# EasyEDA Pro project NI接口485_测试板子_3.eprj, schematic Schematic2
Create Date: 2023-08-04; Page Name: 接NI; Project Name: NI接口485_测试板子_3; Schematic Name: Schematic2; Update Date: 2023-08-29; Company: 嘉立创EDA; Page Size: A4; Version: V1.0
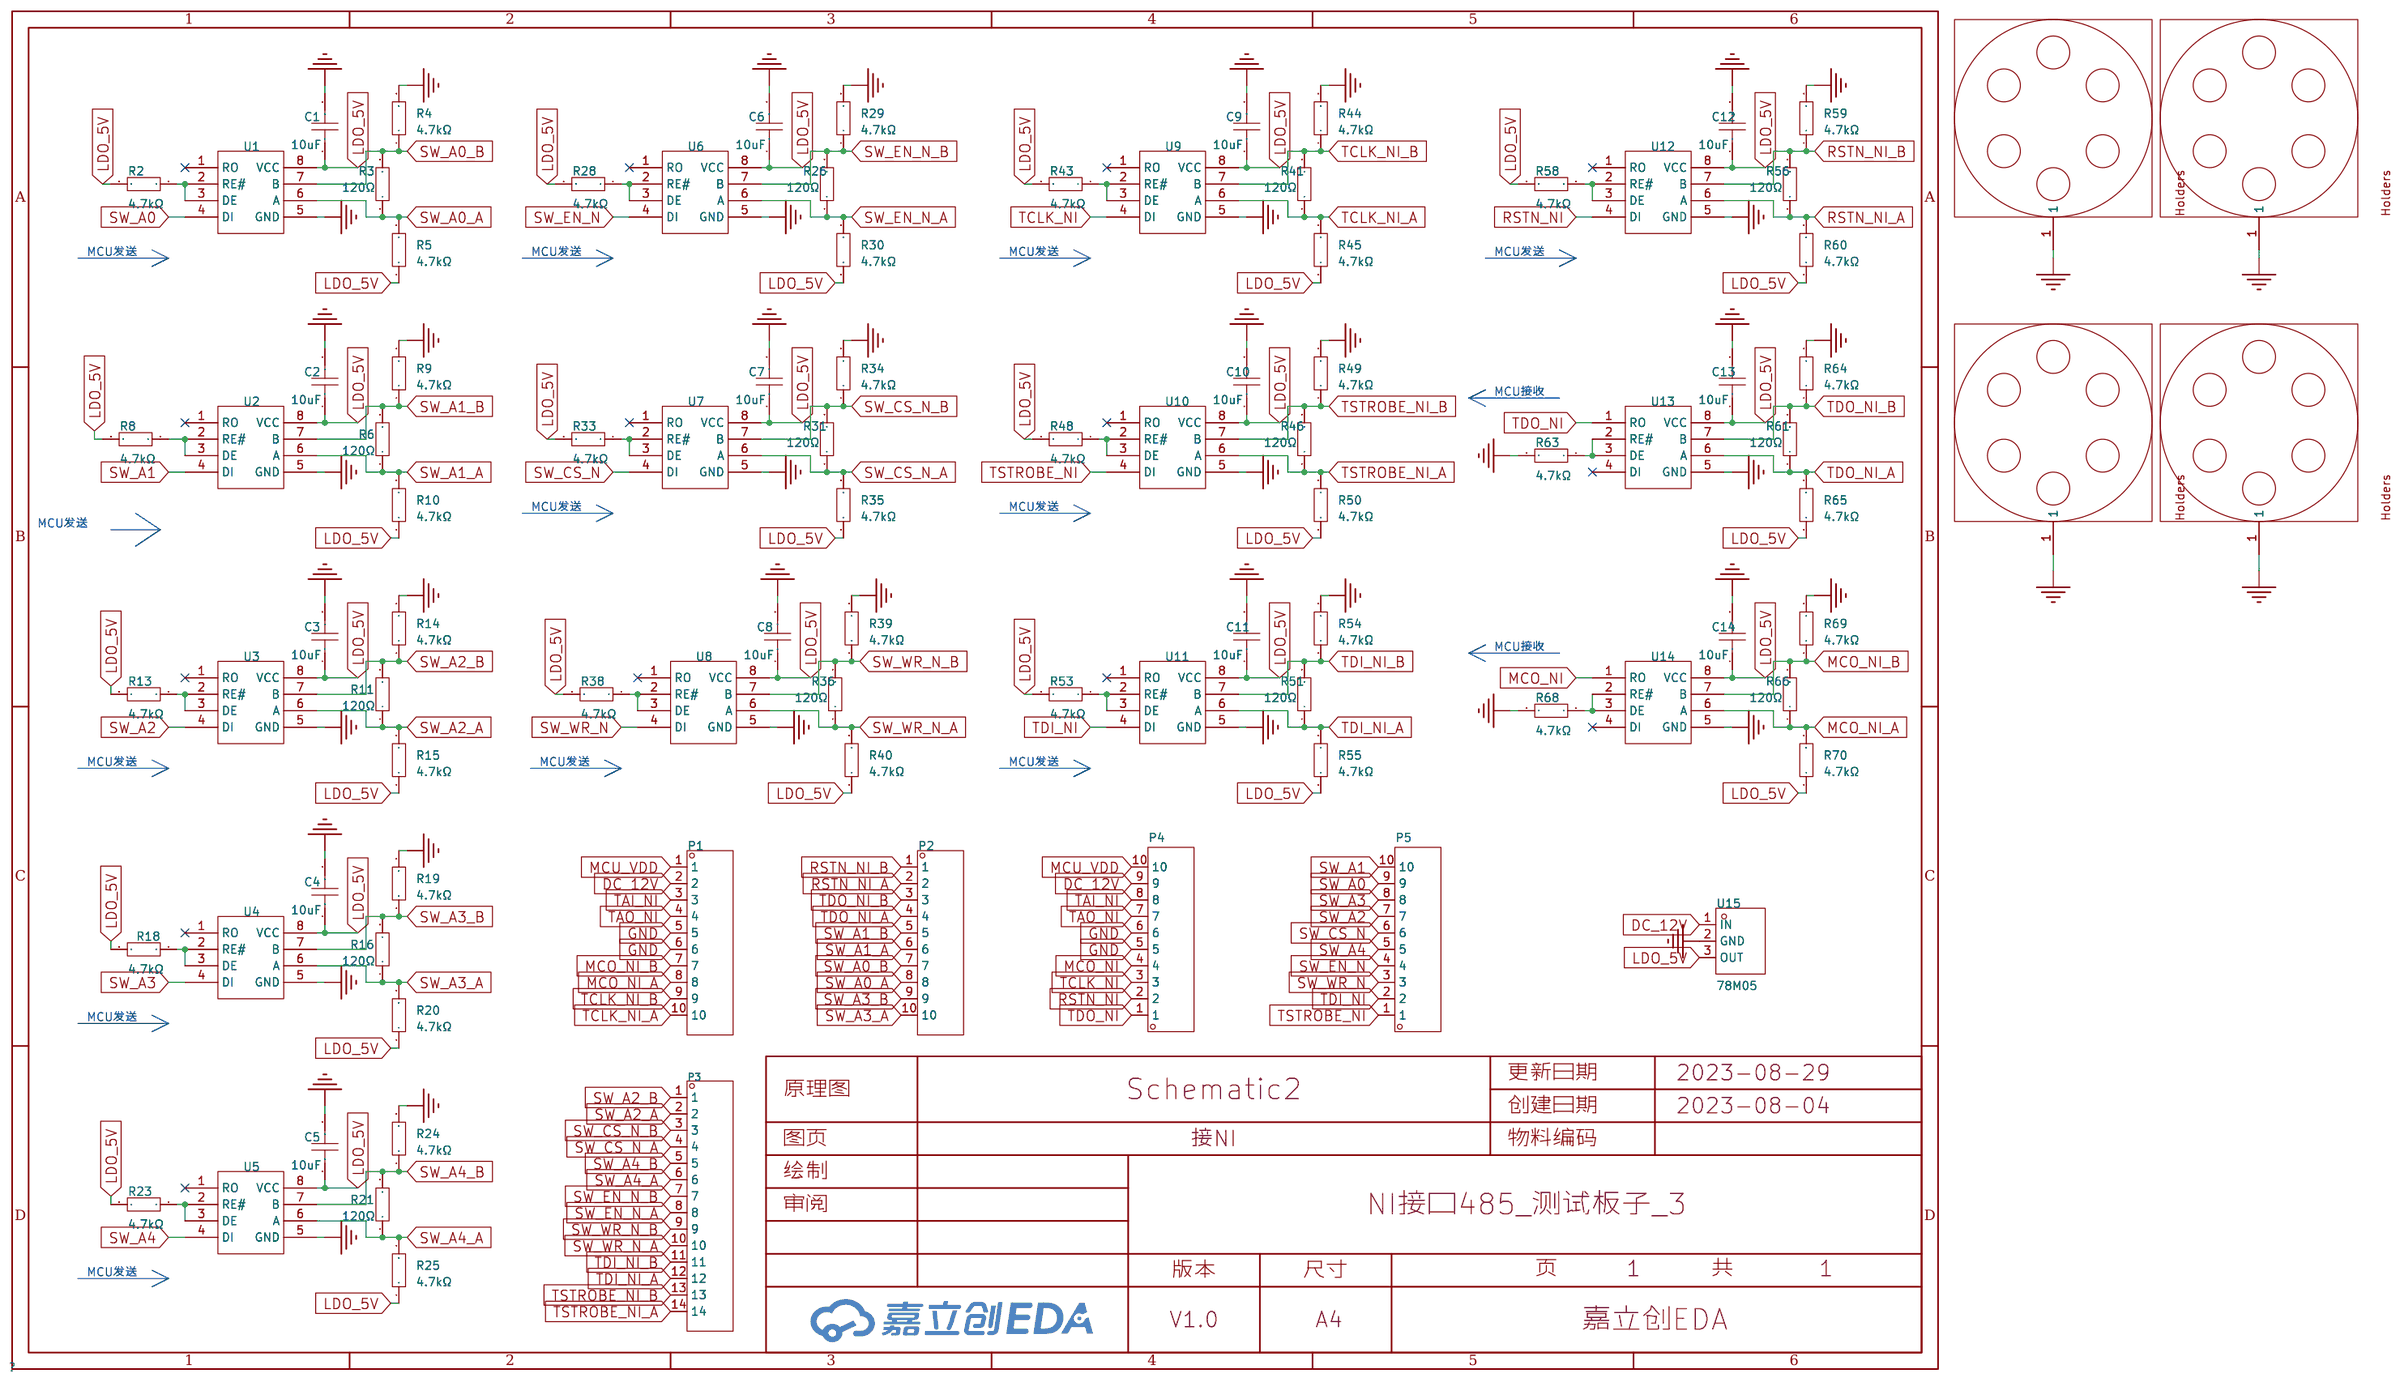
[diagram p1: schematic sheet]

## Parts
C1  10uF  [C0603]
C2  10uF  [C0603]
C3  10uF  [C0603]
C4  10uF  [C0603]
C5  10uF  [C0603]
C6  10uF  [C0603]
C7  10uF  [C0603]
C8  10uF  [C0603]
C9  10uF  [C0603]
C10  10uF  [C0603]
C11  10uF  [C0603]
C12  10uF  [C0603]
C13  10uF  [C0603]
C14  10uF  [C0603]
J1  -  [DEMO板安装孔]
J2  -  [DEMO板安装孔]
J3  -  [DEMO板安装孔]
J4  -  [DEMO板安装孔]
P1  WJ15EDGRC-3.81-10P  [CONN-TH_10P-P3.81_WJ15EDGRC-3.81-10P]
P2  WJ15EDGRC-3.81-10P  [CONN-TH_10P-P3.81_WJ15EDGRC-3.81-10P]
P3  WJ15EDGRC-3.81-14P  [CONN-TH_14P-P3.81_WJ15EDGRC-3.81-14P]
P4  WJ15EDGRC-3.81-10P  [CONN-TH_10P-P3.81_WJ15EDGRC-3.81-10P]
P5  WJ15EDGRC-3.81-10P  [CONN-TH_10P-P3.81_WJ15EDGRC-3.81-10P]
R2  4.7kΩ  [R0603]
R3  120Ω  [R0603]
R4  4.7kΩ  [R0603]
R5  4.7kΩ  [R0603]
R6  120Ω  [R0603]
R8  4.7kΩ  [R0603]
R9  4.7kΩ  [R0603]
R10  4.7kΩ  [R0603]
R11  120Ω  [R0603]
R13  4.7kΩ  [R0603]
R14  4.7kΩ  [R0603]
R15  4.7kΩ  [R0603]
R16  120Ω  [R0603]
R18  4.7kΩ  [R0603]
R19  4.7kΩ  [R0603]
R20  4.7kΩ  [R0603]
R21  120Ω  [R0603]
R23  4.7kΩ  [R0603]
R24  4.7kΩ  [R0603]
R25  4.7kΩ  [R0603]
R26  120Ω  [R0603]
R28  4.7kΩ  [R0603]
R29  4.7kΩ  [R0603]
R30  4.7kΩ  [R0603]
R31  120Ω  [R0603]
R33  4.7kΩ  [R0603]
R34  4.7kΩ  [R0603]
R35  4.7kΩ  [R0603]
R36  120Ω  [R0603]
R38  4.7kΩ  [R0603]
R39  4.7kΩ  [R0603]
R40  4.7kΩ  [R0603]
R41  120Ω  [R0603]
R43  4.7kΩ  [R0603]
R44  4.7kΩ  [R0603]
R45  4.7kΩ  [R0603]
R46  120Ω  [R0603]
R48  4.7kΩ  [R0603]
R49  4.7kΩ  [R0603]
R50  4.7kΩ  [R0603]
R51  120Ω  [R0603]
R53  4.7kΩ  [R0603]
R54  4.7kΩ  [R0603]
R55  4.7kΩ  [R0603]
R56  120Ω  [R0603]
R58  4.7kΩ  [R0603]
R59  4.7kΩ  [R0603]
R60  4.7kΩ  [R0603]
R61  120Ω  [R0603]
R63  4.7kΩ  [R0603]
R64  4.7kΩ  [R0603]
R65  4.7kΩ  [R0603]
R66  120Ω  [R0603]
R68  4.7kΩ  [R0603]
R69  4.7kΩ  [R0603]
R70  4.7kΩ  [R0603]
U1  SP485EEN-L/TR  [SOIC-8_L5.0-W4.0-P1.27-LS6.0-BL]
U2  SP485EEN-L/TR  [SOIC-8_L5.0-W4.0-P1.27-LS6.0-BL]
U3  SP485EEN-L/TR  [SOIC-8_L5.0-W4.0-P1.27-LS6.0-BL]
U4  SP485EEN-L/TR  [SOIC-8_L5.0-W4.0-P1.27-LS6.0-BL]
U5  SP485EEN-L/TR  [SOIC-8_L5.0-W4.0-P1.27-LS6.0-BL]
U6  SP485EEN-L/TR  [SOIC-8_L5.0-W4.0-P1.27-LS6.0-BL]
U7  SP485EEN-L/TR  [SOIC-8_L5.0-W4.0-P1.27-LS6.0-BL]
U8  SP485EEN-L/TR  [SOIC-8_L5.0-W4.0-P1.27-LS6.0-BL]
U9  SP485EEN-L/TR  [SOIC-8_L5.0-W4.0-P1.27-LS6.0-BL]
U10  SP485EEN-L/TR  [SOIC-8_L5.0-W4.0-P1.27-LS6.0-BL]
U11  SP485EEN-L/TR  [SOIC-8_L5.0-W4.0-P1.27-LS6.0-BL]
U12  SP485EEN-L/TR  [SOIC-8_L5.0-W4.0-P1.27-LS6.0-BL]
U13  SP485EEN-L/TR  [SOIC-8_L5.0-W4.0-P1.27-LS6.0-BL]
U14  SP485EEN-L/TR  [SOIC-8_L5.0-W4.0-P1.27-LS6.0-BL]
U15  78M05  [TO-252-2_L6.5-W5.5-P4.58-LS9.8-BR-CW]

## Library data of the parts
C1-C14 = CL10A106KP8NNNC: 容值:10uF;精度:±10%;额定电压:10V;材质(温度系数):X5R;; LCSC Part Name: 10uF ±10% 10V; Supplier Part: C19702; Manufacturer: SAMSUNG(三星); Supplier Footprint: 0603; JLCPCB Part Class: Basic Part; Datasheet: https://atta.szlcsc.com/upload/public/pdf/source/20160103/1457707703378.pdf; Supplier: LCSC; Tolerance: ±10%; Voltage Rated: 10V; Temperature Coefficient: X5R
J1-J4 = 螺孔_3.1X6MM
P1 P2 P4 P5 = WJ15EDGRC-3.81-10P: 连接器类型:板端/插座-闭口;间距:3.81mm;排数:1;每排PIN数:10;安装方式:弯针;颜色:绿色;; LCSC Part Name: 板端/插座-闭口 3.81mm 排数:1 每排P数:10 弯针; Supplier Part: C26895; Manufacturer: KANGNEX(康奈克斯电气); Supplier Footprint: P=3.81mm; JLCPCB Part Class: Extended Part; Datasheet: https://atta.szlcsc.com/upload/public/pdf/source/20191225/C26895_4D916DB43CEF69A0001F97FDF773E4BF.pdf; Supplier: LCSC; Connector Type: 板端/插座-闭口; Pitch: 3.81mm; Number of Rows: 1; Number of PINs Per Row: 10; Mounting Style: 弯针; Color: 绿色
P3 = WJ15EDGRC-3.81-14P: 连接器类型:板端/插座-闭口;结构:1x14P;间距:3.81mm;排数:1;每排PIN数:14;安装方式:弯针;颜色:绿色;; LCSC Part Name: 板端/插座-闭口 1x14P 3.81mm 排数:1 每排P数:14 弯针; Supplier Part: C31933; Manufacturer: KANGNEX(康奈克斯电气); Supplier Footprint: 弯插,P=3.81mm; JLCPCB Part Class: Extended Part; Datasheet: https://atta.szlcsc.com/upload/public/pdf/source/20191225/C31933_D56DE114D60976BC410F77D80AC71242.pdf; Supplier: LCSC; Connector Type: 板端/插座-闭口; Structure: 1x14P; Pitch: 3.81mm; Number of Rows: 1; Number of PINs Per Row: 14; Mounting Style: 弯针; Color: 绿色
R2 R4 R5 R8-R10 R13-R15 R18-R20 R23-R25 R28-R30 R33-R35 R38-R40 R43-R45 R48-R50 R53-R55 R58-R60 R63-R65 R68-R70 = 0603WAF4701T5E: 电阻类型:厚膜电阻;阻值:4.7kΩ;精度:±1%;功率:100mW;; LCSC Part Name: 4.7kΩ ±1% 100mW; Supplier Part: C23162; Manufacturer: UNI-ROYAL(厚声); Supplier Footprint: 0603; JLCPCB Part Class: Basic Part; Datasheet: https://atta.szlcsc.com/upload/public/pdf/source/20200306/C422600_1E6D84923E4A46A82E41ADD87F860B5C.pdf; Supplier: LCSC; Type: 厚膜电阻; Tolerance: ±1%; Power(Watts): 100mW; Temperature Coefficient: ±100ppm/℃; Overload Voltage (Max): 75V; Operating Temperature Range: -55℃~+155℃
R3 R6 R11 R16 R21 R26 R31 R36 R41 R46 R51 R56 R61 R66 = 0603WAF1200T5E: 电阻类型:厚膜电阻;阻值:120Ω;精度:±1%;功率:100mW;; LCSC Part Name: 120Ω ±1% 100mW; Supplier Part: C22787; Manufacturer: UNI-ROYAL(厚声); Supplier Footprint: 0603; JLCPCB Part Class: Basic Part; Datasheet: https://atta.szlcsc.com/upload/public/pdf/source/20200306/C422600_1E6D84923E4A46A82E41ADD87F860B5C.pdf; Supplier: LCSC; Type: 厚膜电阻; Tolerance: ±1%; Power(Watts): 100mW; Temperature Coefficient: ±100ppm/℃; Overload Voltage (Max): 75V; Operating Temperature Range: -55℃~+155℃
U1-U14 = SP485EEN-L/TR: 类型:收发器;驱动器/接收器:1/1;数据速率:10Mbps;; LCSC Part Name: 5V供电 10Mbps 收发器; Supplier Part: C6855; Manufacturer: MaxLinear; Supplier Footprint: SOIC-8; JLCPCB Part Class: Basic Part; Datasheet: https://atta.szlcsc.com/upload/public/pdf/source/20210125/C916163_66C97B5ACCC910994E8B10780F9BD300.pdf; Supplier: LCSC; Types: 收发器; Driver/receiver: 1/1; Data Rate: 10Mbps; Supply Voltage: 4.75V~5.25V
U15 = 78M05_C2891842: 输出类型:固定;输出极性:正;输出通道数:1;最大输入电压:35V;输出电压:5V;压差:2.5V@(350mA);输出电流:1A;电源纹波抑制比(PSRR):80dB@(120Hz);工作温度:±125℃@(Tj);; LCSC Part Name: 正 Vin=35V Vout=5V 1A 80dB@(120Hz); Supplier Part: C2891842; Manufacturer: YONGYUTAI(永裕泰); Supplier Footprint: TO-252-2L; JLCPCB Part Class: Extended Part; Datasheet: https://atta.szlcsc.com/upload/public/pdf/source/20210901/9F6110692DF5A8FBE511D2C7DBEC8E01.pdf; Supplier: LCSC; Output Type: 固定; Output Polarity: 正; Number of Outputs: 1; Maximum Input Voltage: 35V; Output Voltage: 5V; Dropout Voltage: 2.5V@(350mA); Output Current: 1A; Power Supply Rejection Ratio (PSRR): 80dB@(120Hz); Operating Temperature: ±125℃@(Tj)

## Nets
GND: C1.2 C2.2 C3.2 C4.2 C5.2 C6.2 C7.2 C8.2 C9.2 C10.2 C11.2 C12.2 C13.2 C14.2 J1.1 J2.1 J3.1 J4.1 P1.5 P1.6 P4.5 P4.6 R4.2 R9.2 R14.2 R19.2 R24.2 R29.2 R34.2 R39.2 R44.2 R49.2 R54.2 R59.2 R63.2 R64.2 R68.2 R69.2 U1.5(GND) U2.5(GND) U3.5(GND) U4.5(GND) U5.5(GND) U6.5(GND) U7.5(GND) U8.5(GND) U9.5(GND) U10.5(GND) U11.5(GND) U12.5(GND) U13.5(GND) U14.5(GND) U15.2(GND)
DC_12V: P1.2 P4.9 U15.1(IN)
LDO_5V: C1.1 C2.1 C3.1 C4.1 C5.1 C6.1 C7.1 C8.1 C9.1 C10.1 C11.1 C12.1 C13.1 C14.1 R2.2 R5.1 R8.2 R10.1 R13.2 R15.1 R18.2 R20.1 R23.2 R25.1 R28.2 R30.1 R33.2 R35.1 R38.2 R40.1 R43.2 R45.1 R48.2 R50.1 R53.2 R55.1 R58.2 R60.1 R65.1 R70.1 U1.8(VCC) U2.8(VCC) U3.8(VCC) U4.8(VCC) U5.8(VCC) U6.8(VCC) U7.8(VCC) U8.8(VCC) U9.8(VCC) U10.8(VCC) U11.8(VCC) U12.8(VCC) U13.8(VCC) U14.8(VCC) U15.3(OUT)
MCO_NI: P4.4 U14.1(RO)
MCO_NI_A: P1.8 R66.1 R70.2 U14.6(A)
MCO_NI_B: P1.7 R66.2 R69.1 U14.7(B)
MCU_VDD: P1.1 P4.10
RSTN_NI: P4.2 U12.4(DI)
RSTN_NI_A: P2.2 R56.1 R60.2 U12.6(A)
RSTN_NI_B: P2.1 R56.2 R59.1 U12.7(B)
SW_A0: P5.9 U1.4(DI)
SW_A0_A: P2.8 R3.1 R5.2 U1.6(A)
SW_A0_B: P2.7 R3.2 R4.1 U1.7(B)
SW_A1: P5.10 U2.4(DI)
SW_A1_A: P2.6 R6.1 R10.2 U2.6(A)
SW_A1_B: P2.5 R6.2 R9.1 U2.7(B)
SW_A2: P5.7 U3.4(DI)
SW_A2_A: P3.2 R11.1 R15.2 U3.6(A)
SW_A2_B: P3.1 R11.2 R14.1 U3.7(B)
SW_A3: P5.8 U4.4(DI)
SW_A3_A: P2.10 R16.1 R20.2 U4.6(A)
SW_A3_B: P2.9 R16.2 R19.1 U4.7(B)
SW_A4: P5.5 U5.4(DI)
SW_A4_A: P3.6 R21.1 R25.2 U5.6(A)
SW_A4_B: P3.5 R21.2 R24.1 U5.7(B)
SW_CS_N: P5.6 U7.4(DI)
SW_CS_N_A: P3.4 R31.1 R35.2 U7.6(A)
SW_CS_N_B: P3.3 R31.2 R34.1 U7.7(B)
SW_EN_N: P5.4 U6.4(DI)
SW_EN_N_A: P3.8 R26.1 R30.2 U6.6(A)
SW_EN_N_B: P3.7 R26.2 R29.1 U6.7(B)
SW_WR_N: P5.3 U8.4(DI)
SW_WR_N_A: P3.10 R36.1 R40.2 U8.6(A)
SW_WR_N_B: P3.9 R36.2 R39.1 U8.7(B)
TAI_NI: P1.3 P4.8
TAO_NI: P1.4 P4.7
TCLK_NI: P4.3 U9.4(DI)
TCLK_NI_A: P1.10 R41.1 R45.2 U9.6(A)
TCLK_NI_B: P1.9 R41.2 R44.1 U9.7(B)
TDI_NI: P5.2 U11.4(DI)
TDI_NI_A: P3.12 R51.1 R55.2 U11.6(A)
TDI_NI_B: P3.11 R51.2 R54.1 U11.7(B)
TDO_NI: P4.1 U13.1(RO)
TDO_NI_A: P2.4 R61.1 R65.2 U13.6(A)
TDO_NI_B: P2.3 R61.2 R64.1 U13.7(B)
TSTROBE_NI: P5.1 U10.4(DI)
TSTROBE_NI_A: P3.14 R46.1 R50.2 U10.6(A)
TSTROBE_NI_B: P3.13 R46.2 R49.1 U10.7(B)
$1N33003: R2.1 U1.2(RE#) U1.3(DE)
$1N33046: R8.1 U2.2(RE#) U2.3(DE)
$1N33127: R13.1 U3.2(RE#) U3.3(DE)
$1N33159: R18.1 U4.2(RE#) U4.3(DE)
$1N33197: R23.1 U5.2(RE#) U5.3(DE)
$1N33551: R28.1 U6.2(RE#) U6.3(DE)
$1N33913: R33.1 U7.2(RE#) U7.3(DE)
$1N34275: R38.1 U8.2(RE#) U8.3(DE)
$1N34989: R43.1 U9.2(RE#) U9.3(DE)
$1N35351: R48.1 U10.2(RE#) U10.3(DE)
$1N35713: R53.1 U11.2(RE#) U11.3(DE)
$1N36075: R58.1 U12.2(RE#) U12.3(DE)
$1N36432: R63.1 U13.2(RE#) U13.3(DE)
$1N36797: R68.1 U14.2(RE#) U14.3(DE)

Not connected (* = marked no-connect by the designer): U1 1(RO)*; U2 1(RO)*; U3 1(RO)*; U4 1(RO)*; U5 1(RO)*; U6 1(RO)*; U7 1(RO)*; U8 1(RO)*; U9 1(RO)*; U10 1(RO)*; U11 1(RO)*; U12 1(RO)*; U13 4(DI)*; U14 4(DI)*

## Notes on the sheet
- MCU发送
- MCU发送
- MCU发送
- MCU发送
- MCU接收
- MCU发送
- MCU发送
- MCU发送
- MCU接收
- MCU发送
- MCU发送
- MCU发送
- MCU发送
- MCU发送
